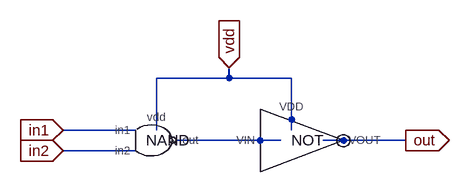
[diagram p0: schematic and.asc]
and.asc, the LTspice schematic file:
Version 4
SHEET 1 880 680
WIRE 256 32 256 16
WIRE 256 32 144 32
WIRE 352 32 256 32
WIRE 112 112 0 112
WIRE 144 112 144 32
WIRE 352 112 352 32
WIRE 336 128 176 128
WIRE 528 128 400 128
WIRE 112 144 0 144
FLAG 0 144 in2
IOPIN 0 144 In
FLAG 256 16 vdd
IOPIN 256 16 In
FLAG 528 128 out
IOPIN 528 128 Out
FLAG 0 112 in1
IOPIN 0 112 In
SYMBOL nand 128 128 R0
WINDOW 0 0 0 Left 2
SYMATTR InstName NAND
SYMBOL inverter 352 128 R0
WINDOW 0 0 0 Left 2
SYMATTR InstName NOT

The netlist it stands for:
* and.asc
XNAND in1 in2 N001 vdd nand  ; pins in1 in2 out vdd
XNOT vdd out N001 inverter  ; pins VDD VOUT VIN
.backanno
.end